# Altium schematic sheet NAND_FLASH_MT29F2G16AABWP.SchDoc
size A4
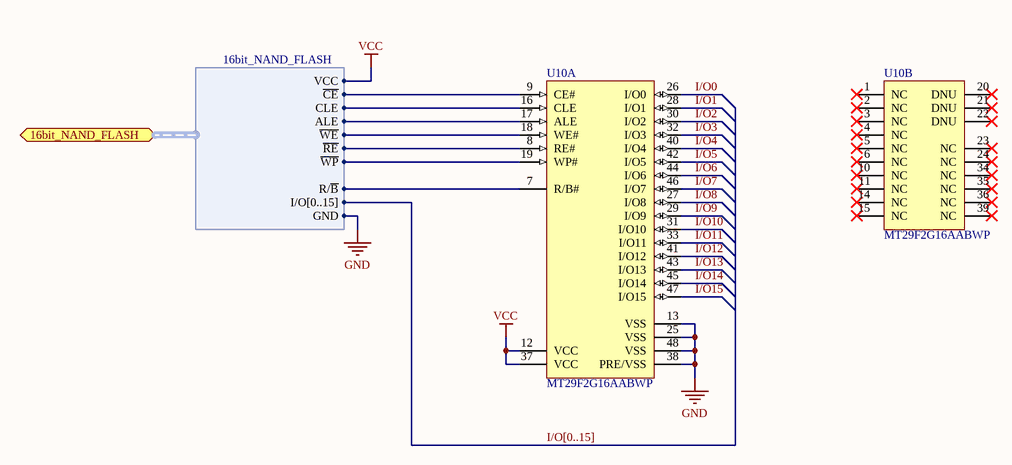
[diagram p0: NAND_FLASH_MT29F2G16AABWP.SchDoc]

## Parts
U10  MT29F2G16AABWP  [MICT-WP-48_L]  (parts A,B of 2)

## Ports
16bit_NAND_FLASH (harness 16bit_NAND_FLASH)

## Harnesses
16bit_NAND_FLASH: VCC, ~{CE}, CLE, ALE, ~{WE}, ~{RE}, ~{WP}, R/~{B}, I/O[0..15], GND

## Nets
GND: U10.13(VSS) U10.25(VSS) U10.38(PRE/VSS) U10.48(VSS) ; port 16bit_NAND_FLASH.GND
VCC: U10.12(VCC) U10.37(VCC) ; port 16bit_NAND_FLASH.VCC
I/O0: U10.26(I/O0)
I/O1: U10.28(I/O1)
I/O2: U10.30(I/O2)
I/O3: U10.32(I/O3)
I/O4: U10.40(I/O4)
I/O5: U10.42(I/O5)
I/O6: U10.44(I/O6)
I/O7: U10.46(I/O7)
I/O8: U10.27(I/O8)
I/O9: U10.29(I/O9)
I/O10: U10.31(I/O10)
I/O11: U10.33(I/O11)
I/O12: U10.41(I/O12)
I/O13: U10.43(I/O13)
I/O14: U10.45(I/O14)
I/O15: U10.47(I/O15)
NetU10_7: U10.7(R/B#) ; port 16bit_NAND_FLASH.R/~{B}
NetU10_8: U10.8(RE#) ; port 16bit_NAND_FLASH.~{RE}
NetU10_9: U10.9(CE#) ; port 16bit_NAND_FLASH.~{CE}
NetU10_16: U10.16(CLE) ; port 16bit_NAND_FLASH.CLE
NetU10_17: U10.17(ALE) ; port 16bit_NAND_FLASH.ALE
NetU10_18: U10.18(WE#) ; port 16bit_NAND_FLASH.~{WE}
NetU10_19: U10.19(WP#) ; port 16bit_NAND_FLASH.~{WP}

Not connected (* = marked no-connect by the designer): U10 1(NC)* 2(NC)* 3(NC)* 4(NC)* 5(NC)* 6(NC)* 10(NC)* 11(NC)* 14(NC)* 15(NC)* 20(DNU)* 21(DNU)* 22(DNU)* 23(NC)* 24(NC)* 34(NC)* 35(NC)* 36(NC)* 39(NC)*

## Buses and harness runs
bus I/O[0..15]

## Library data of the parts
U10 = CMP-0760-00001-1: 2 Gb x 16 Multiplexed NAND Flash Memory, 2.7 to 3.6 V, 0 to 70 degC, 48-Pin TSOP, RoHS; Manufacturer: Micron; Device Width: 16 Bits; Generation: 2nd Generation Die; Density: 2 Gb; PartNumber: MT29F2G16AABWP; ComponentLink1Description: Manufacturer URL; Operating Temperature: 0 to 70 degC; RoHS: TRUE; ComponentLink1URL: http://www.micron.com/; Mounting Technology: Surface Mount; ComponentLink2URL: http://www.micron.com/~/media/Documents/Products/Data%20Sheet/NAND%20Flash/20%20Series/2gb_nand_m29b.pdf; ComponentLink3URL: http://www.micron.com/~/media/Documents/Products/Data%20Sheet/NAND%20Flash/20%20Series/2gb_nand_m29b.pdf; ComponentLink2Description: Datasheet; DatasheetVersion: Rev. I; ComponentLink3Description: Package Specification; PackageReference: WP-48; PackageVersion: Rev. I; VCC: 2.7 to 3.6V; PackageDescription: 48-Pin Thin Small Outline Package, Body 12 x 18.4 mm, Pitch 0.5 mm; PartId: 1